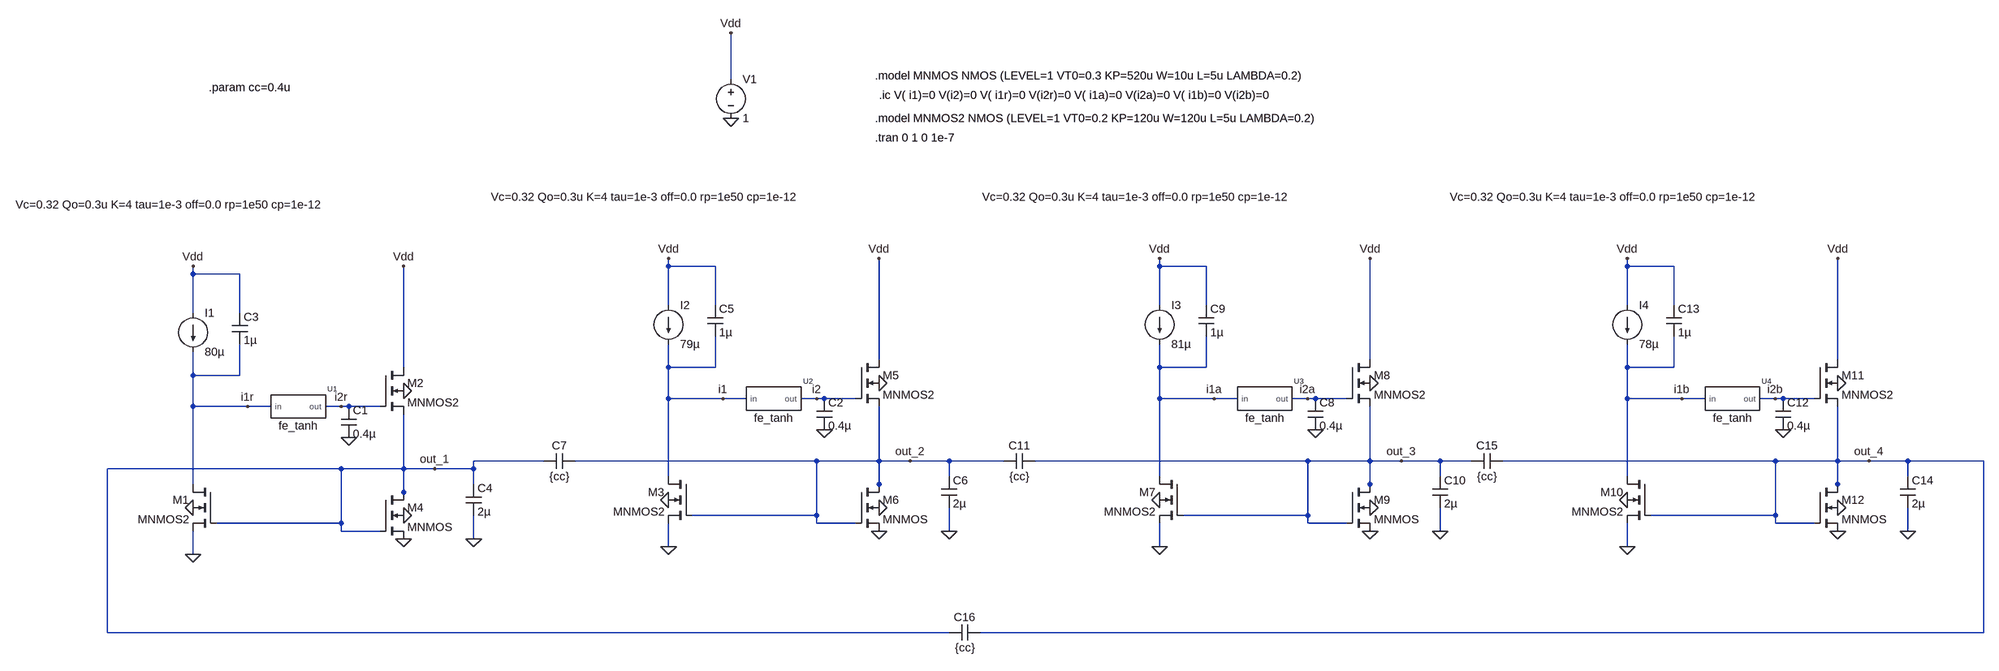
[diagram p0: schematic Neuron_oscillator_coupled_oscillators.asc]
Neuron_oscillator_coupled_oscillators.asc, the LTspice schematic file:
Version 4
SHEET 1 2116 944
WIRE -496 -320 -496 -416
WIRE -624 112 -624 96
WIRE -528 112 -624 112
WIRE 384 112 384 96
WIRE 480 112 384 112
WIRE 1344 112 1344 96
WIRE 1440 112 1344 112
WIRE -1600 128 -1600 112
WIRE -1504 128 -1600 128
WIRE -624 192 -624 112
WIRE -528 192 -528 112
WIRE 384 192 384 112
WIRE 480 192 480 112
WIRE 1344 192 1344 112
WIRE 1440 192 1440 112
WIRE -1600 208 -1600 128
WIRE -1504 208 -1504 128
WIRE -192 304 -192 96
WIRE 816 304 816 96
WIRE 1776 304 1776 96
WIRE -1168 320 -1168 112
WIRE -624 320 -624 272
WIRE -528 320 -528 256
WIRE -528 320 -624 320
WIRE 384 320 384 272
WIRE 480 320 480 256
WIRE 480 320 384 320
WIRE 1344 320 1344 272
WIRE 1440 320 1440 256
WIRE 1440 320 1344 320
WIRE -1600 336 -1600 288
WIRE -1504 336 -1504 272
WIRE -1504 336 -1600 336
WIRE -624 384 -624 320
WIRE -512 384 -624 384
WIRE -464 384 -512 384
WIRE -320 384 -352 384
WIRE -304 384 -320 384
WIRE -240 384 -304 384
WIRE 384 384 384 320
WIRE 496 384 384 384
WIRE 544 384 496 384
WIRE 688 384 656 384
WIRE 704 384 688 384
WIRE 768 384 704 384
WIRE 1344 384 1344 320
WIRE 1456 384 1344 384
WIRE 1504 384 1456 384
WIRE 1648 384 1616 384
WIRE 1664 384 1648 384
WIRE 1728 384 1664 384
WIRE -1600 400 -1600 336
WIRE -1488 400 -1600 400
WIRE -1440 400 -1488 400
WIRE -1296 400 -1328 400
WIRE -1280 400 -1296 400
WIRE -1216 400 -1280 400
WIRE -880 512 -1024 512
WIRE -320 512 -816 512
WIRE -192 512 -192 400
WIRE -192 512 -320 512
WIRE -128 512 -192 512
WIRE -48 512 -128 512
WIRE 64 512 -48 512
WIRE 688 512 128 512
WIRE 816 512 816 400
WIRE 816 512 688 512
WIRE 880 512 816 512
WIRE 960 512 880 512
WIRE 1024 512 960 512
WIRE 1648 512 1088 512
WIRE 1776 512 1776 400
WIRE 1776 512 1648 512
WIRE 1840 512 1776 512
WIRE 1920 512 1840 512
WIRE 2112 512 1920 512
WIRE -1296 528 -1776 528
WIRE -1168 528 -1168 416
WIRE -1168 528 -1296 528
WIRE -1104 528 -1168 528
WIRE -1024 528 -1024 512
WIRE -1024 528 -1104 528
WIRE -624 544 -624 384
WIRE -48 544 -48 512
WIRE 384 544 384 384
WIRE 960 544 960 512
WIRE 1344 544 1344 384
WIRE 1920 544 1920 512
WIRE -1600 560 -1600 400
WIRE -1024 560 -1024 528
WIRE -192 560 -192 512
WIRE 816 560 816 512
WIRE 1776 560 1776 512
WIRE -1168 576 -1168 528
WIRE -192 576 -192 560
WIRE 816 576 816 560
WIRE 1776 576 1776 560
WIRE -1168 592 -1168 576
WIRE -320 624 -320 512
WIRE -320 624 -576 624
WIRE 688 624 688 512
WIRE 688 624 432 624
WIRE 1648 624 1648 512
WIRE 1648 624 1392 624
WIRE -1296 640 -1296 528
WIRE -1296 640 -1552 640
WIRE -320 640 -320 624
WIRE -240 640 -320 640
WIRE 688 640 688 624
WIRE 768 640 688 640
WIRE 1648 640 1648 624
WIRE 1728 640 1648 640
WIRE -1296 656 -1296 640
WIRE -1216 656 -1296 656
WIRE -48 656 -48 608
WIRE 960 656 960 608
WIRE 1920 656 1920 608
WIRE -1024 672 -1024 624
WIRE -624 688 -624 640
WIRE 384 688 384 640
WIRE 1344 688 1344 640
WIRE -1600 704 -1600 656
WIRE -1776 896 -1776 528
WIRE -48 896 -1776 896
WIRE 2112 896 2112 512
WIRE 2112 896 16 896
FLAG -496 -240 0
FLAG -496 -416 Vdd
FLAG -1600 704 0
FLAG -1600 608 0
FLAG -1600 112 Vdd
FLAG -1168 112 Vdd
FLAG -1168 368 0
FLAG -1280 464 0
FLAG -1488 400 i1r
FLAG -1024 672 0
FLAG -1168 672 0
FLAG -1168 624 0
FLAG -1104 528 out_1
FLAG -1296 400 i2r
FLAG -624 688 0
FLAG -624 592 0
FLAG -624 96 Vdd
FLAG -192 96 Vdd
FLAG -192 352 0
FLAG -304 448 0
FLAG -512 384 i1
FLAG -48 656 0
FLAG -192 656 0
FLAG -192 608 0
FLAG -128 512 out_2
FLAG -320 384 i2
FLAG 384 688 0
FLAG 384 592 0
FLAG 384 96 Vdd
FLAG 816 96 Vdd
FLAG 816 352 0
FLAG 704 448 0
FLAG 496 384 i1a
FLAG 960 656 0
FLAG 816 656 0
FLAG 816 608 0
FLAG 880 512 out_3
FLAG 688 384 i2a
FLAG 1344 688 0
FLAG 1344 592 0
FLAG 1344 96 Vdd
FLAG 1776 96 Vdd
FLAG 1776 352 0
FLAG 1664 448 0
FLAG 1456 384 i1b
FLAG 1920 656 0
FLAG 1776 656 0
FLAG 1776 608 0
FLAG 1840 512 out_4
FLAG 1648 384 i2b
SYMBOL voltage -496 -336 R0
WINDOW 123 0 0 Left 0
WINDOW 39 0 0 Left 0
SYMATTR InstName V1
SYMATTR Value 1
SYMBOL nmos4 -1552 560 M0
SYMATTR InstName M1
SYMATTR Value MNMOS2
SYMBOL nmos4 -1216 320 R0
SYMATTR InstName M2
SYMATTR Value MNMOS2
SYMBOL cap -1296 400 R0
SYMATTR InstName C1
SYMATTR Value 0.4µ
SYMBOL current -1600 208 R0
WINDOW 123 0 0 Left 0
WINDOW 39 0 0 Left 0
SYMATTR InstName I1
SYMATTR Value 80µ
SYMBOL cap -1520 208 R0
SYMATTR InstName C3
SYMATTR Value 1µ
SYMBOL cap -1040 560 R0
SYMATTR InstName C4
SYMATTR Value 2µ
SYMBOL nmos4 -1216 576 R0
SYMATTR InstName M4
SYMATTR Value MNMOS
SYMBOL fe_tanh -1392 400 R0
WINDOW 39 -257 -430 Top 2
SYMATTR SpiceLine Vc=0.32 Qo=0.3u K=4 tau=1e-3 off=0.0 rp=1e50 cp=1e-12
SYMATTR InstName U1
SYMBOL nmos4 -576 544 M0
SYMATTR InstName M3
SYMATTR Value MNMOS2
SYMBOL nmos4 -240 304 R0
SYMATTR InstName M5
SYMATTR Value MNMOS2
SYMBOL cap -320 384 R0
SYMATTR InstName C2
SYMATTR Value 0.4µ
SYMBOL current -624 192 R0
WINDOW 123 0 0 Left 0
WINDOW 39 0 0 Left 0
SYMATTR InstName I2
SYMATTR Value 79µ
SYMBOL cap -544 192 R0
SYMATTR InstName C5
SYMATTR Value 1µ
SYMBOL cap -64 544 R0
SYMATTR InstName C6
SYMATTR Value 2µ
SYMBOL nmos4 -240 560 R0
SYMATTR InstName M6
SYMATTR Value MNMOS
SYMBOL fe_tanh -416 384 R0
WINDOW 39 -257 -430 Top 2
SYMATTR SpiceLine Vc=0.32 Qo=0.3u K=4 tau=1e-3 off=0.0 rp=1e50 cp=1e-12
SYMATTR InstName U2
SYMBOL cap -816 496 R90
WINDOW 0 0 32 VBottom 2
WINDOW 3 32 32 VTop 2
SYMATTR InstName C7
SYMATTR Value {cc}
SYMBOL nmos4 432 544 M0
SYMATTR InstName M7
SYMATTR Value MNMOS2
SYMBOL nmos4 768 304 R0
SYMATTR InstName M8
SYMATTR Value MNMOS2
SYMBOL cap 688 384 R0
SYMATTR InstName C8
SYMATTR Value 0.4µ
SYMBOL current 384 192 R0
WINDOW 123 0 0 Left 0
WINDOW 39 0 0 Left 0
SYMATTR InstName I3
SYMATTR Value 81µ
SYMBOL cap 464 192 R0
SYMATTR InstName C9
SYMATTR Value 1µ
SYMBOL cap 944 544 R0
SYMATTR InstName C10
SYMATTR Value 2µ
SYMBOL nmos4 768 560 R0
SYMATTR InstName M9
SYMATTR Value MNMOS
SYMBOL fe_tanh 592 384 R0
WINDOW 39 -257 -430 Top 2
SYMATTR SpiceLine Vc=0.32 Qo=0.3u K=4 tau=1e-3 off=0.0 rp=1e50 cp=1e-12
SYMATTR InstName U3
SYMBOL cap 128 496 R90
WINDOW 0 0 32 VBottom 2
WINDOW 3 32 32 VTop 2
SYMATTR InstName C11
SYMATTR Value {cc}
SYMBOL nmos4 1392 544 M0
SYMATTR InstName M10
SYMATTR Value MNMOS2
SYMBOL nmos4 1728 304 R0
SYMATTR InstName M11
SYMATTR Value MNMOS2
SYMBOL cap 1648 384 R0
SYMATTR InstName C12
SYMATTR Value 0.4µ
SYMBOL current 1344 192 R0
WINDOW 123 0 0 Left 0
WINDOW 39 0 0 Left 0
SYMATTR InstName I4
SYMATTR Value 78µ
SYMBOL cap 1424 192 R0
SYMATTR InstName C13
SYMATTR Value 1µ
SYMBOL cap 1904 544 R0
SYMATTR InstName C14
SYMATTR Value 2µ
SYMBOL nmos4 1728 560 R0
SYMATTR InstName M12
SYMATTR Value MNMOS
SYMBOL fe_tanh 1552 384 R0
WINDOW 39 -257 -430 Top 2
SYMATTR SpiceLine Vc=0.32 Qo=0.3u K=4 tau=1e-3 off=0.0 rp=1e50 cp=1e-12
SYMATTR InstName U4
SYMBOL cap 1088 496 R90
WINDOW 0 0 32 VBottom 2
WINDOW 3 32 32 VTop 2
SYMATTR InstName C15
SYMATTR Value {cc}
SYMBOL cap 16 880 R90
WINDOW 0 0 32 VBottom 2
WINDOW 3 32 32 VTop 2
SYMATTR InstName C16
SYMATTR Value {cc}
TEXT -200 -328 Left 2 !.model MNMOS NMOS (LEVEL=1 VT0=0.3 KP=520u W=10u L=5u LAMBDA=0.2)
TEXT -200 -200 Left 2 !.tran 0 1 0 1e-7
TEXT -192 -288 Left 2 !.ic V( i1)=0 V(i2)=0 V( i1r)=0 V(i2r)=0 V( i1a)=0 V(i2a)=0 V( i1b)=0 V(i2b)=0
TEXT -200 -240 Left 2 !.model MNMOS2 NMOS (LEVEL=1 VT0=0.2 KP=120u W=120u L=5u LAMBDA=0.2)
TEXT -1568 -304 Left 2 !.param cc=0.4u

The netlist it stands for:
* Neuron_oscillator_coupled_oscillators.asc
V1 Vdd 0 1
M1 i1r out_1 0 0 MNMOS2
M2 Vdd i2r out_1 0 MNMOS2
C1 i2r 0 0.4µ
I1 Vdd i1r 80µ
C3 Vdd i1r 1µ
C4 out_1 0 2µ
M4 out_1 out_1 0 0 MNMOS
XU1 i1r i2r fe_tanh Vc=0.32 Qo=0.3u K=4 tau=1e-3 off=0.0 rp=1e50 cp=1e-12  ; pins in out
M3 i1 out_2 0 0 MNMOS2
M5 Vdd i2 out_2 0 MNMOS2
C2 i2 0 0.4µ
I2 Vdd i1 79µ
C5 Vdd i1 1µ
C6 out_2 0 2µ
M6 out_2 out_2 0 0 MNMOS
XU2 i1 i2 fe_tanh Vc=0.32 Qo=0.3u K=4 tau=1e-3 off=0.0 rp=1e50 cp=1e-12  ; pins in out
C7 out_2 out_1 {cc}
M7 i1a out_3 0 0 MNMOS2
M8 Vdd i2a out_3 0 MNMOS2
C8 i2a 0 0.4µ
I3 Vdd i1a 81µ
C9 Vdd i1a 1µ
C10 out_3 0 2µ
M9 out_3 out_3 0 0 MNMOS
XU3 i1a i2a fe_tanh Vc=0.32 Qo=0.3u K=4 tau=1e-3 off=0.0 rp=1e50 cp=1e-12  ; pins in out
C11 out_3 out_2 {cc}
M10 i1b out_4 0 0 MNMOS2
M11 Vdd i2b out_4 0 MNMOS2
C12 i2b 0 0.4µ
I4 Vdd i1b 78µ
C13 Vdd i1b 1µ
C14 out_4 0 2µ
M12 out_4 out_4 0 0 MNMOS
XU4 i1b i2b fe_tanh Vc=0.32 Qo=0.3u K=4 tau=1e-3 off=0.0 rp=1e50 cp=1e-12  ; pins in out
C15 out_4 out_3 {cc}
C16 out_4 out_1 {cc}
.model NMOS NMOS
.model PMOS PMOS
.lib standard.mos
.model MNMOS NMOS (LEVEL=1 VT0=0.3 KP=520u W=10u L=5u LAMBDA=0.2)
.tran 0 1 0 1e-7
.ic V( i1)=0 V(i2)=0 V( i1r)=0 V(i2r)=0 V( i1a)=0 V(i2a)=0 V( i1b)=0 V(i2b)=0
.model MNMOS2 NMOS (LEVEL=1 VT0=0.2 KP=120u W=120u L=5u LAMBDA=0.2)
.param cc=0.4u
.lib ./fe_tanh_ni.sp
.backanno
.end